# Altium project PCB_Project-1tg227.PrjPcb
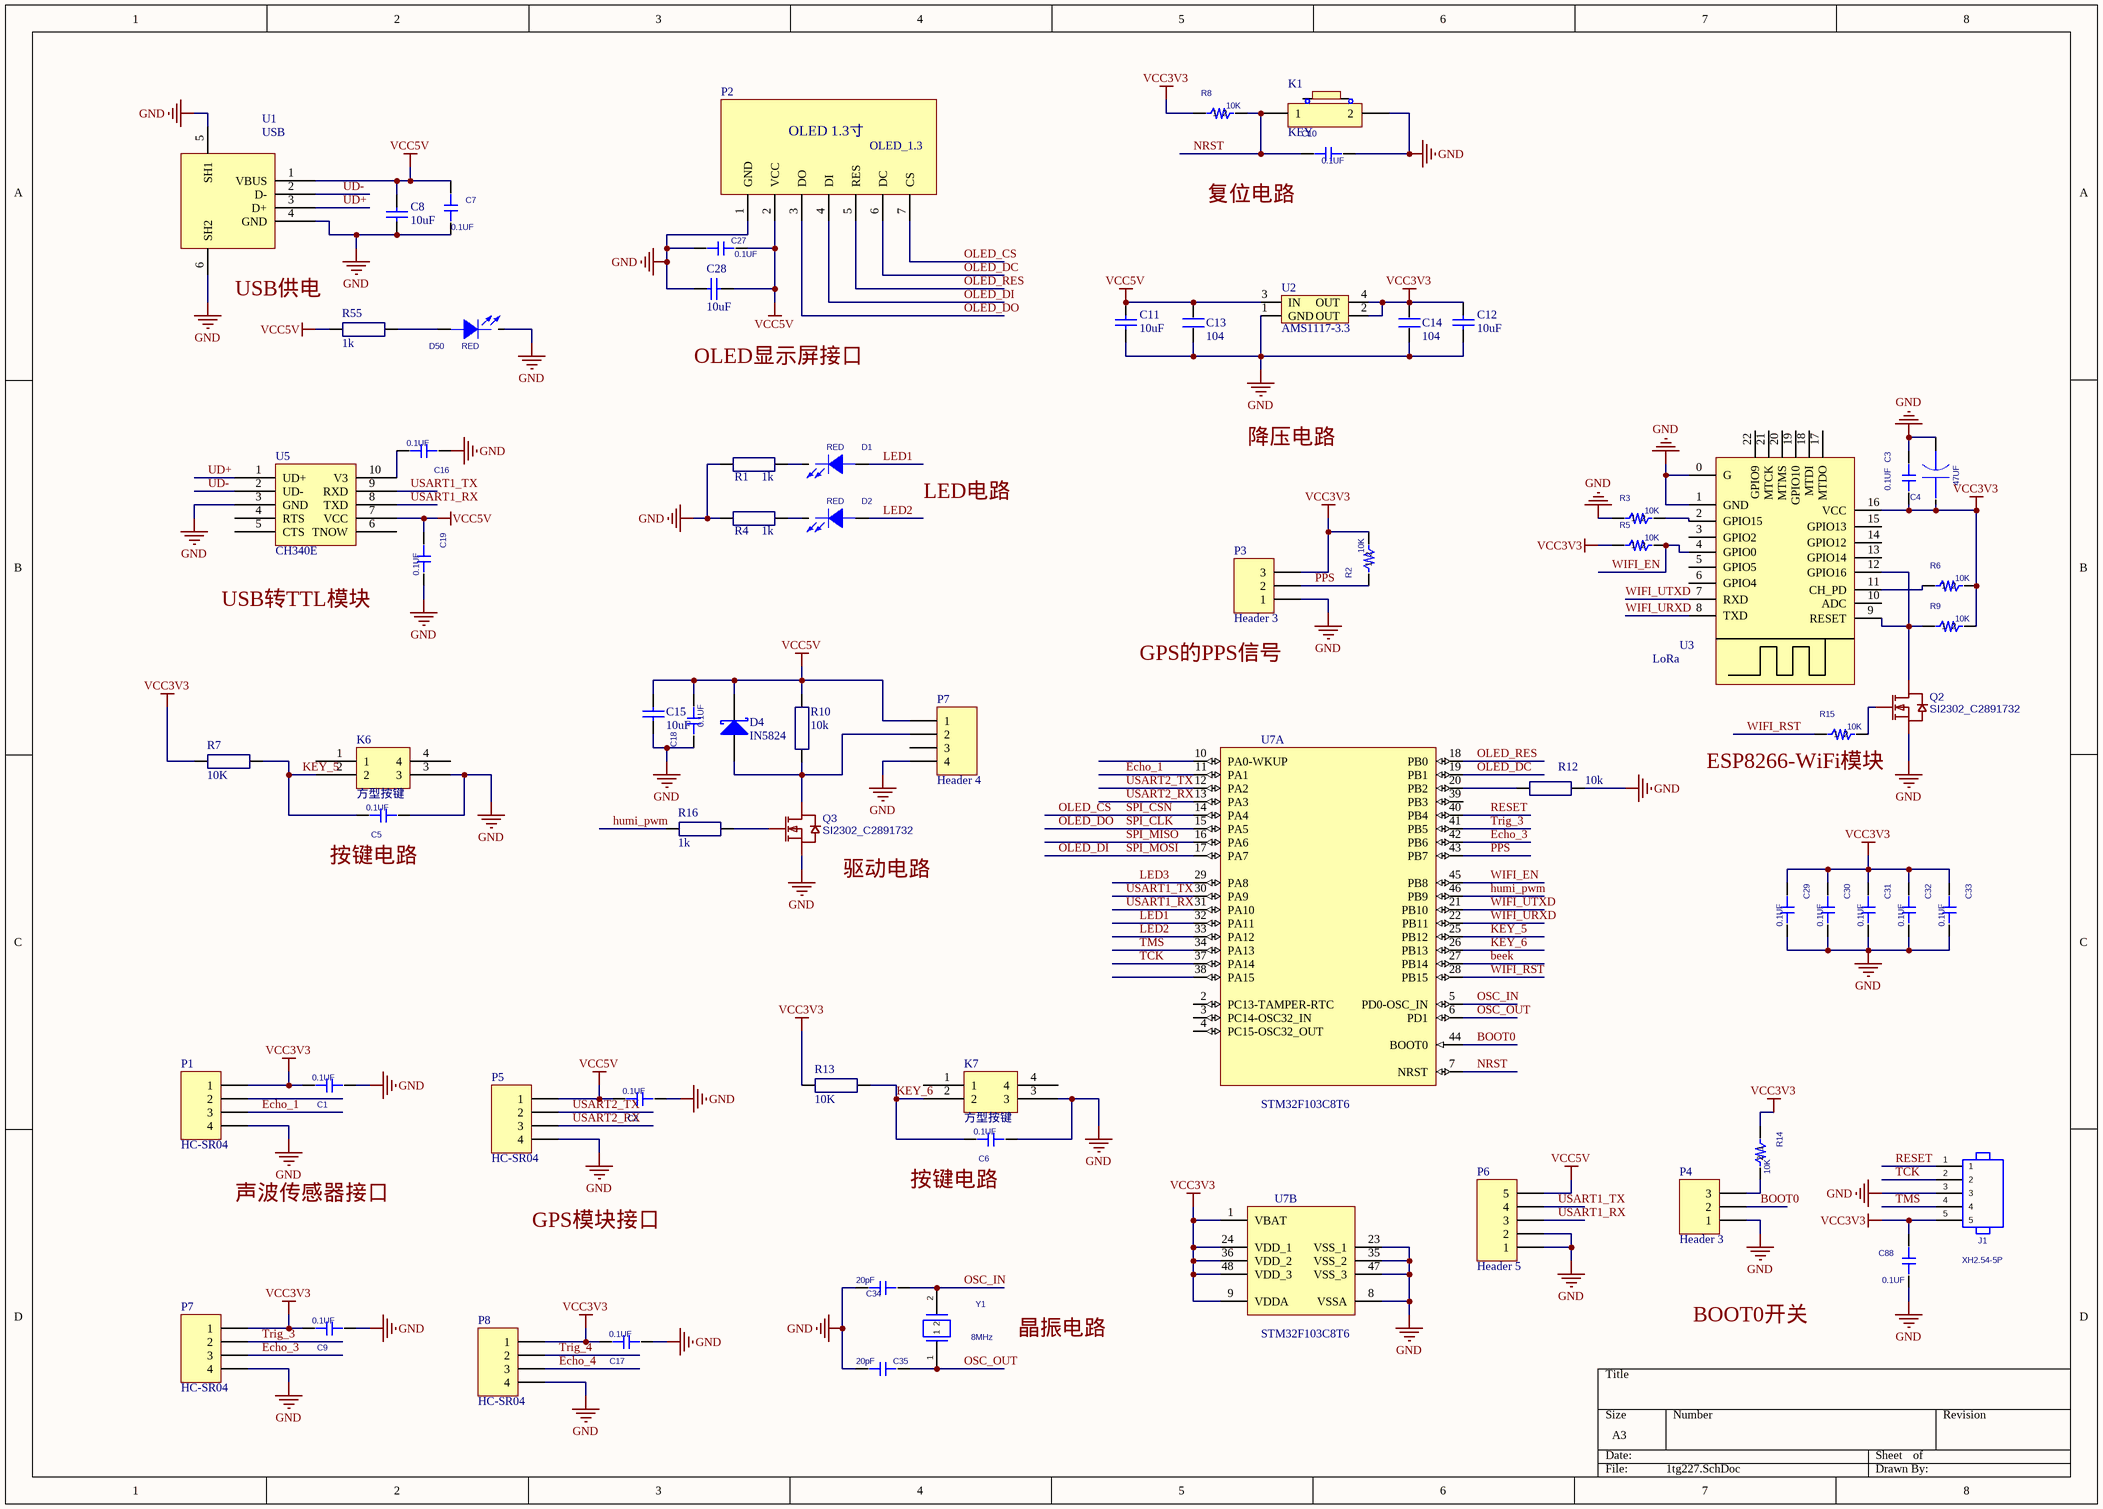
[diagram p0: 1tg227.SchDoc]
1 sheet, 70 parts. Net scope: global (net labels, ports and power ports of the same name join across sheets).
Board file: 1tg227.PcbDoc

## Sheet 1tg227.SchDoc
size A3

### Parts
(Parts that share a designator on the sheet are numbered #1, #2 ... from top to bottom, then left to right.)
C1  value 0.1UF  [LC-0603_C]  (hidden comment: CAP_0.1UF_0603_FIRE)
C2  value 0.1UF  [LC-0603_C]  (hidden comment: CAP_0.1UF_0603_FIRE)
C3  value 0.1UF  [CAP_0603_FIRE]  (hidden comment: CAP_0.1UF_0603_FIRE)
C4  value 47UF  [CAP+_47UF_FIRE]  (hidden comment: CAP+_47UF_FIRE)
C5  value 0.1UF  [LC-0603_C]  (hidden comment: CAP_0.1UF_0603_FIRE)
C6  value 0.1UF  [LC-0603_C]  (hidden comment: CAP_0.1UF_0603_FIRE)
C7  value 0.1UF  [LC-0603_C]  (hidden comment: CAP_0.1UF_0603_FIRE)
C8  value 10uF  [LC-0805_C]  (hidden comment: 104)
C9  value 0.1UF  [LC-0603_C]  (hidden comment: CAP_0.1UF_0603_FIRE)
C10  value 0.1UF  [LC-0603_C]  (hidden comment: CAP_0.1UF_0603_FIRE)
C11  value 10uF  [LC-0805_C]  (hidden comment: 104)
C12  value 10uF  [LC-0805_C]  (hidden comment: 104)
C13  104  [0603P]
C14  104  [0603P]
C15  value 10uF  [LC-0805_C]  (hidden comment: 104)
C16  value 0.1UF  [LC-0603_C]  (hidden comment: CAP_0.1UF_0603_FIRE)
C17  value 0.1UF  [LC-0603_C]  (hidden comment: CAP_0.1UF_0603_FIRE)
C18  value 0.1UF  [LC-0603_C]  (hidden comment: CAP_0.1UF_0603_FIRE)
C19  value 0.1UF  [LC-0603_C]  (hidden comment: CAP_0.1UF_0603_FIRE)
C27  value 0.1UF  [LC-0603_C]  (hidden comment: CAP_0.1UF_0603_FIRE)
C28  value 10uF  [LC-0805_C]  (hidden comment: 104)
C29  value 0.1UF  [LC-0603_C]  (hidden comment: CAP_0.1UF_0603_FIRE)
C30  value 0.1UF  [LC-0603_C]  (hidden comment: CAP_0.1UF_0603_FIRE)
C31  value 0.1UF  [LC-0603_C]  (hidden comment: CAP_0.1UF_0603_FIRE)
C32  value 0.1UF  [LC-0603_C]  (hidden comment: CAP_0.1UF_0603_FIRE)
C33  value 0.1UF  [LC-0603_C]  (hidden comment: CAP_0.1UF_0603_FIRE)
C34  value 20pF  [LC-0402_C]  (hidden comment: C_22P_0603)
C35  value 20pF  [LC-0402_C]  (hidden comment: C_22P_0603)
C88  value 0.1UF  [LC-0603_C]  (hidden comment: CAP_0.1UF_0603_FIRE)
D1  value RED  [LED_RED_0603_FIRE]  (hidden comment: LED_RED_0603_FIRE)
D2  value RED  [LED_RED_0603_FIRE]  (hidden comment: LED_RED_0603_FIRE)
D4  IN5824  [DO-214AC(SSxxx)]
D50  value RED  [LED_RED_0603_FIRE]  (hidden comment: LED_RED_0603_FIRE)
J1  XH2.54-5P  [XH2.54-5P]
K1  KEY  [KEY_SW]
K6  方型按键  [key]
K7  方型按键  [key]
P1  HC-SR04  [HDR1X4]
P2  OLED_1.3  [OLED_1.3]
P3  Header 3  [HDR1X3]
P4  Header 3  [HDR1X3]
P5  HC-SR04  [HDR1X4]
P6  Header 5  [HDR1X5]
P7#1  Header 4  [HDR1X4]
P7#2  HC-SR04  [HDR1X4]
P8  HC-SR04  [HDR1X4]
Q2  SI2302_C2891732  [SOT-23-3_L2.9-W1.3-P1.90-LS2.4-BR]
Q3  SI2302_C2891732  [SOT-23-3_L2.9-W1.3-P1.90-LS2.4-BR]
R1  value 1k  [LC-0603_R]  (hidden comment: RES)
R2  value 10K  [LC-0603_R]  (hidden comment: RES_10K_0603_FIRE)
R3  value 10K  [RES_0603_FIRE]  (hidden comment: RES_10K_0603_FIRE)
R4  value 1k  [LC-0603_R]  (hidden comment: RES)
R5  value 10K  [RES_0603_FIRE]  (hidden comment: RES_10K_0603_FIRE)
R6  value 10K  [RES_0603_FIRE]  (hidden comment: RES_10K_0603_FIRE)
R7  value 10K  [LC-0603_R]  (hidden comment: RES)
R8  value 10K  [LC-0603_R]  (hidden comment: RES_10K_0603_FIRE)
R9  value 10K  [RES_0603_FIRE]  (hidden comment: RES_10K_0603_FIRE)
R10  value 10k  [LC-0603_R]  (hidden comment: RES)
R12  value 10k  [LC-0603_R]  (hidden comment: RES)
R13  value 10K  [LC-0603_R]  (hidden comment: RES)
R14  value 10K  [LC-0603_R]  (hidden comment: RES_10K_0603_FIRE)
R15  value 10K  [RES_0603_FIRE]  (hidden comment: RES_10K_0603_FIRE)
R16  value 1k  [LC-0603_R]  (hidden comment: RES)
R55  value 1k  [LC-0603_R]  (hidden comment: RES)
U1  USB  [USB-B]
U2  AMS1117-3.3  [AMS1117]
U3  LoRa  [ESP-12S Module]
U5  CH340E  [SOP10 - duplicate]
U7  STM32F103C8T6  [LQFP48_N]  (parts A,B of 2)
Y1  value 8MHz  [OSC_8M]  (hidden comment: XTAL_8M_FIRE)

### Nets
GND: C1.1 C2.1 C3.1 C4.2 C5.1 C6.1 C7.2 C8.2 C9.1 C10.2 C11.2 C12.2 C13.1 C14.1 C15.1 C16.1 C17.1 C18.1 C19.2 C27.2 C28.1 C29.2 C30.2 C31.2 C32.2 C33.2 C34.1 C35.1 C88.2 D50.K(CATHODE) J1.3 K1.2 K6.3 K7.3 P1.4 P2.1(GND) P3.1 P4.1 P5.4 P6.1 P6.2 P7#1.4 P7#2.4 P8.4 Q2.2(S) Q3.2(S) R1.1 R3.1 R4.1 R12.2 U1.4(GND) U1.5(SH1) U1.6(SH2) U2.1(GND) U3.0(G) U3.1(GND) U5.3(GND) U7.8(VSSA) U7.23(VSS_1) U7.35(VSS_2) U7.47(VSS_3)
VCC3V3: C1.2 C3.2 C4.1 C9.2 C12.1 C14.2 C17.2 C29.1 C30.1 C31.1 C32.1 C33.1 C88.1 J1.5 P1.1 P3.3 P7#2.1 P8.1 R2.2 R5.1 R6.2 R7.1 R8.1 R9.2 R13.1 R14.1 U2.2(OUT) U2.4(OUT) U3.16(VCC) U7.1(VBAT) U7.9(VDDA) U7.24(VDD_1) U7.36(VDD_2) U7.48(VDD_3)
VCC5V: C2.2 C7.1 C8.1 C11.1 C13.2 C15.2 C18.2 C19.1 C27.1 C28.2 D4.2(K) P2.2(VCC) P5.1 P6.5 P7#1.1 R10.2 R55.2 U1.1(VBUS) U2.3(IN) U5.7(VCC)
beek: U7.27(PB14)
BOOT0: P4.2 U7.44(BOOT0)
Echo_1: P1.3 U7.11(PA1)
Echo_3: P7#2.3 U7.42(PB6)
Echo_4: P8.3
humi_pwm: R16.1 U7.46(PB9)
KEY_5: C5.2 K6.2 R7.2 U7.25(PB12)
KEY_6: C6.2 K7.2 R13.2 U7.26(PB13)
LED1: D1.A(ANODE) U7.32(PA11)
LED2: D2.A(ANODE) U7.33(PA12)
LED3: U7.29(PA8)
NRST: C10.1 K1.1 R8.2 U7.7(NRST)
OLED_CS: P2.7(CS) U7.14(PA4)  [also labelled SPI_CSN]
OLED_DC: P2.6(DC) U7.19(PB1)
OLED_DI: P2.4(DI) U7.17(PA7)  [also labelled SPI_MOSI]
OLED_DO: P2.3(DO) U7.15(PA5)  [also labelled SPI_CLK]
OLED_RES: P2.5(RES) U7.18(PB0)
OSC_IN: C34.2 U7.5(PD0-OSC_IN) Y1.2
OSC_OUT: C35.2 U7.6(PD1) Y1.1
PPS: P3.2 R2.1 U7.43(PB7)
RESET: J1.1 U7.40(PB4)
SPI_MISO: U7.16(PA6)
TCK: J1.2 U7.37(PA14)
TMS: J1.4 U7.34(PA13)
Trig_3: P7#2.2 U7.41(PB5)
Trig_4: P8.2
UD+: U1.3(D+) U5.1(UD+)
UD-: U1.2(D-) U5.2(UD-)
USART1_RX: P6.3 U5.8(TXD) U7.31(PA10)
USART1_TX: P6.4 U5.9(RXD) U7.30(PA9)
USART2_RX: P5.3 U7.13(PA3)
USART2_TX: P5.2 U7.12(PA2)
WIFI_EN: R5.2 U3.4(GPIO0) U7.45(PB8)
WIFI_RST: R15.1 U7.28(PB15)
WIFI_URXD: U3.8(TXD) U7.22(PB11)
WIFI_UTXD: U3.7(RXD) U7.21(PB10)
NetC16_2: C16.2 U5.10(V3)
NetD1_K: D1.K(CATHODE) R1.2
NetD2_K: D2.K(CATHODE) R4.2
NetD4_1: D4.1(A) P7#1.2 Q3.3(D) R10.1
NetD50_A: D50.A(ANODE) R55.1
NetP4_3: P4.3 R14.2
NetQ2_1: Q2.1(G) R15.2
NetQ2_3: Q2.3(D) R9.1 U3.9(RESET) U3.12(GPIO16)
NetQ3_1: Q3.1(G) R16.2
NetR3_2: R3.2 U3.2(GPIO15)
NetR6_1: R6.1 U3.11(CH_PD)
NetR12_1: R12.1 U7.20(PB2)

Not connected (* = marked no-connect by the designer): K6 1 4; K7 1 4; P1 2; P7#1 3; U3 3(GPIO2) 5(GPIO5) 6(GPIO4) 10(ADC) 13(GPIO14) 14(GPIO12) 15(GPIO13) 17(MTDO) 18(MTDI) 19(GPIO10) 20(MTMS) 21(MTCK) 22(GPIO9); U5 4(RTS) 5(CTS) 6(TNOW); U7 2(PC13-TAMPER-RTC) 3(PC14-OSC32_IN) 4(PC15-OSC32_OUT) 10(PA0-WKUP) 38(PA15) 39(PB3)

### Notes on the sheet
- Labels drawn without touching a wire or pin: BOOT0开关, ESP8266-WiFi模块, GPS模块接口, GPS的PPS信号, LED电路, OLED显示屏接口, USB供电, USB转TTL模块, 声波传感器接口, 复位电路, 按键电路, 晶振电路, 降压电路, 驱动电路
- (in symbol OLED_1.3) OLED 1.3寸

### Library data of the parts
C1 C2 C5-C7 C9 C10 C16-C19 C27 C29-C35 C88 = CAP_0.1UF_0603_FIRE: SURFACE MOUNT CAPACITOR 0.031 X 0.061 INCHES; PCB DECAL: CAP_0603_FIRE
C3 = CAP_0.1UF_0603_FIRE: SURFACE MOUNT CAPACITOR 0.031 X 0.061 INCHES; PCB DECAL: CAP_0603_FIRE
C8 C11 C12 C15 C28 = Cap: Capacitor; Published: 8-Jun-2000; LatestRevisionDate: 17-Jul-2002; LatestRevisionNote: Re-released for DXP Platform.; PackageReference: RAD-0.3; Publisher: Altium Limited; PackageDescription: Radial Cap, Thru-Hole; 2 Leads; 0.3 in Pin Spacing
C13 C14 = C
D1 D2 D50 = LED_RED_0603_FIRE: red,0805; PCB DECAL: LED_RED_0603_FIRE
K6 K7 = Component_1
P1 P5 P7#1 P7#2 P8 = Header 4: Header, 4-Pin; LatestRevisionDate: 17-Jul-2002; LatestRevisionNote: Re-released for DXP Platform.; Publisher: Altium Limited
P3 P4 = Header 3: Header, 3-Pin; LatestRevisionDate: 17-Jul-2002; LatestRevisionNote: Re-released for DXP Platform.; Publisher: Altium Limited
P6 = Header 5: Header, 5-Pin; LatestRevisionDate: 17-Jul-2002; LatestRevisionNote: Re-released for DXP Platform.; Publisher: Altium Limited
Q2 Q3 = SI2302_C2891732: BOM_Manufacturer: YONGYUTAI(永裕泰); BOM_Manufacturer Part: SI2302; Contributor: LCSC; BOM_Supplier: LCSC; BOM_Supplier Part: C2891732; BOM_JLCPCB Part Class: Extended Part; spicePre: Q; spiceSymbolName: SI2302_C2891732
R2 R8 R14 = RES_10K_0603_FIRE: SURFACE MOUNT RESISTOR 0.031 X 0.061 INCHES, 1/10W; PCB DECAL: RES_0603_FIRE; Assembly: SMD
R3 R5 R6 R9 R15 = RES_10K_0603_FIRE: SURFACE MOUNT RESISTOR 0.031 X 0.061 INCHES, 1/10W; Assembly: SMD; PCB DECAL: RES_0603_FIRE
U1 = USB-B
U2 = AMS1117
U3 = ESP12-F
U7 = STM32F103C8T6: STM32 ARM-based 32-bit MCU Performance Line with 64 kB Flash, 20 kB Internal RAM, -40 to +85癈 Temperature, 48-Pin LQFP, Tray; DatasheetVersion: rev13.0, Apr-2011; PackageVersion: rev13, Apr-2011; PackageReference: LQFP48; PackageDescription: 48-Pin Low-Profile Quad Flat Pack, 7 x 7 mm Body, 0.5 mm Pitch (LQFP48); ComponentLink1Description: Manufacturer URL; ComponentLink1URL: http://www.st.com/; ComponentLink2Description: STM32F103 Datasheet; ComponentLink2URL: http://www.st.com/internet/com/TECHNICAL_RESOURCES/TECHNICAL_LITERATURE/DATASHEET/CD00161566.pdf; ComponentLink3Description: STM32 Family Web Page; ComponentLink3URL: www.st.com/stm32
Y1 = XTAL_8M_FIRE: CRYSTAL; PCB DECAL: CRYSTAL_SMD_FIRE
C4 = CAP+_47UF_FIRE: PCB DECAL: CAP+_47UF_FIRE
J1 = XH2.54-5P: PCB DECAL: XH2.54-5P